# Altium schematic sheet Connector.SchDoc
size A4
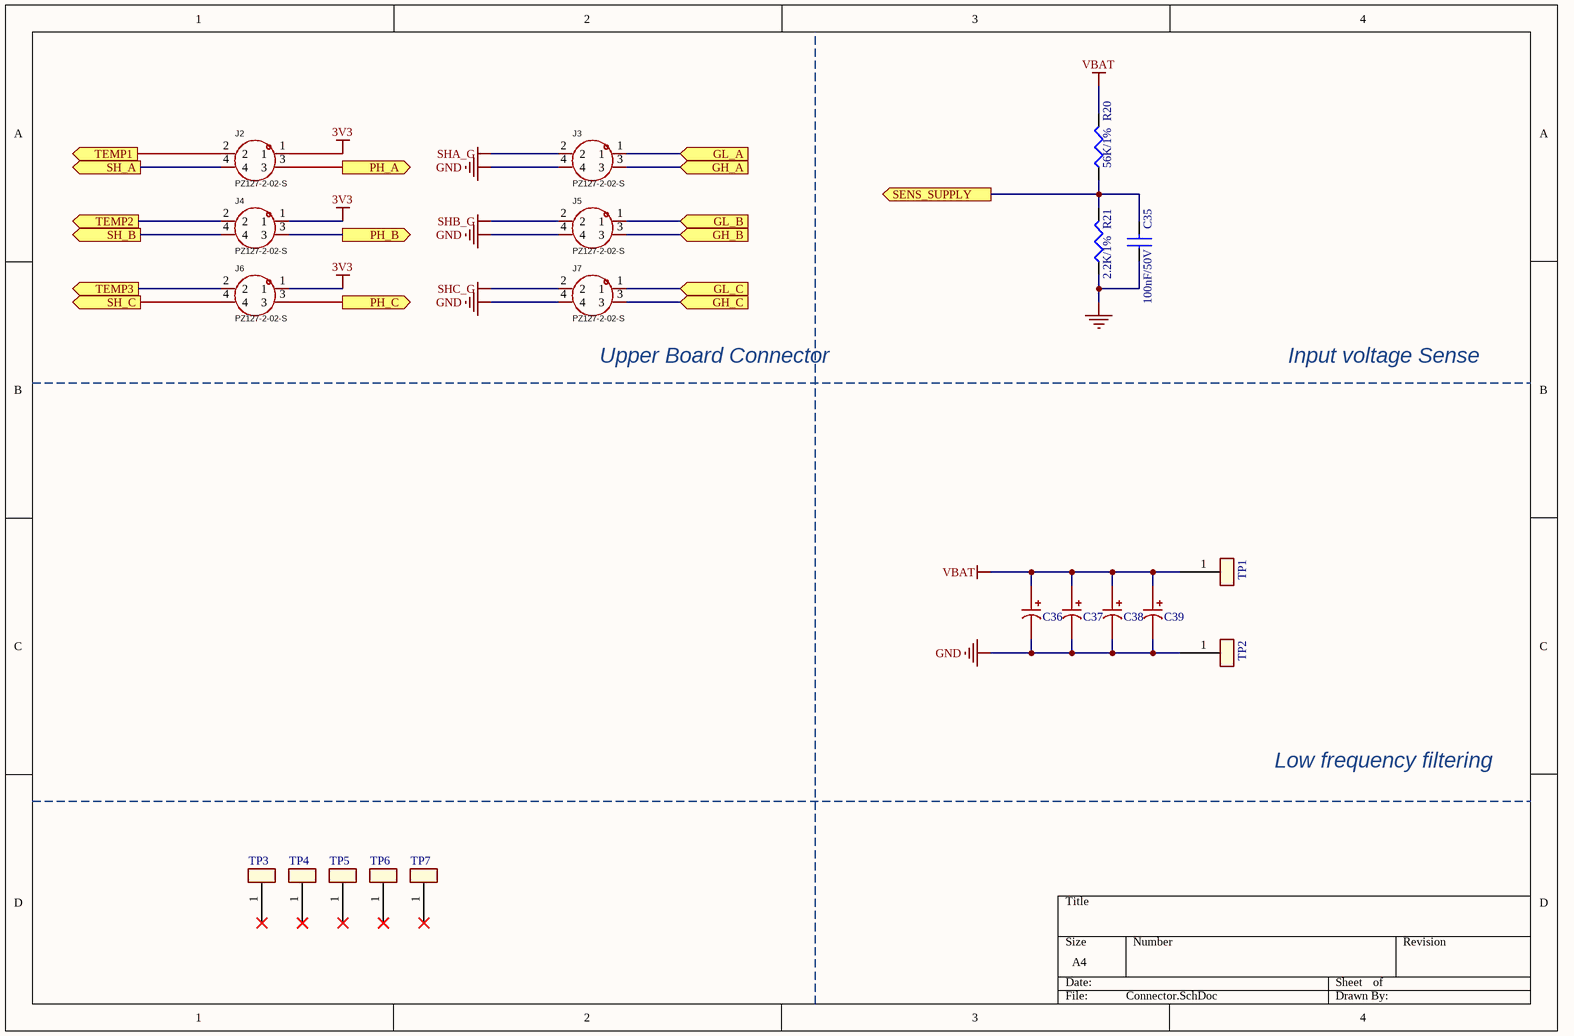
[diagram p0: Connector.SchDoc]

## Parts
C35  100nF/50V  [C0402]
C36  680uF  [CAP-TH_10.0x17mm]  (value not drawn)
C37  680uF  [CAP-TH_10.0x17mm]  (value not drawn)
C38  680uF  [CAP-TH_10.0x17mm]  (value not drawn)
C39  680uF  [CAP-TH_10.0x17mm]  (value not drawn)
J2  PZ127-2-02-S  [HDR-SMD_4P-P1.27-V-M-R2-C2-LS5.3]
J3  PZ127-2-02-S  [HDR-SMD_4P-P1.27-V-M-R2-C2-LS5.3]
J4  PZ127-2-02-S  [HDR-SMD_4P-P1.27-V-M-R2-C2-LS5.3]
J5  PZ127-2-02-S  [HDR-SMD_4P-P1.27-V-M-R2-C2-LS5.3]
J6  PZ127-2-02-S  [HDR-SMD_4P-P1.27-V-M-R2-C2-LS5.3]
J7  PZ127-2-02-S  [HDR-SMD_4P-P1.27-V-M-R2-C2-LS5.3]
R20  56K/1%  [R0402]
R21  2.2K/1%  [R0402]
TP1  TEST POINT  [HOLE-4MM_M]  (value not drawn)
TP2  TEST POINT  [HOLE-4MM_M]  (value not drawn)
TP3  TEST POINT  [HOLE-6.2MM_M]  (value not drawn)
TP4  TEST POINT  [HOLE-6.2MM_M]  (value not drawn)
TP5  TEST POINT  [HOLE-6.2MM_M]  (value not drawn)
TP6  TEST POINT  [HOLE-6.2MM_M]  (value not drawn)
TP7  TEST POINT  [HOLE-6.2MM_M]  (value not drawn)

## Ports
GH_A (in, see VESC_75100[3A]), GH_B (in, see VESC_75100[3B]), GH_C (in, see VESC_75100[3B]), GL_A (in, see VESC_75100[3B]), GL_B (in, see VESC_75100[3B]), GL_C (in, see VESC_75100[3B]), PH_A (out, see VESC_75100[3B]), PH_B (out, see VESC_75100[3B]), PH_C (out, see VESC_75100[3B]), SENS_SUPPLY (out, see VESC_75100[4B]), SH_A (out, see VESC_75100[3B]), SH_B (out, see VESC_75100[3B]), SH_C (out, see VESC_75100[3B]), TEMP1 (out, see VESC_75100[4B]), TEMP2 (out, see VESC_75100[4B]), TEMP3 (out, see VESC_75100[4B])

## Nets
3V3: J2.1 J4.1 J6.1
GND: C35.1 C36.2 C37.2 C38.2 C39.2 J3.4 J5.4 J7.4 R21.1 TP2.1
SHA_G: J3.2
SHB_G: J5.2
SHC_G: J7.2
VBAT: C36.1 C37.1 C38.1 C39.1 R20.2 TP1.1
GH_A: J3.3 ; port GH_A
GH_B: J5.3 ; port GH_B
GH_C: J7.3 ; port GH_C
GL_A: J3.1 ; port GL_A
GL_B: J5.1 ; port GL_B
GL_C: J7.1 ; port GL_C
PH_A: J2.3 ; port PH_A
PH_B: J4.3 ; port PH_B
PH_C: J6.3 ; port PH_C
SENS_SUPPLY: C35.2 R20.1 R21.2 ; port SENS_SUPPLY
SH_A: J2.4 ; port SH_A
SH_B: J4.4 ; port SH_B
SH_C: J6.4 ; port SH_C
TEMP1: J2.2 ; port TEMP1
TEMP2: J4.2 ; port TEMP2
TEMP3: J6.2 ; port TEMP3

Not connected (* = marked no-connect by the designer): TP3 1*; TP4 1*; TP5 1*; TP6 1*; TP7 1*

## Notes on the sheet
- (near J7) Upper Board Connector
- Input voltage Sense
- Low frequency filtering

## Library data of the parts
C35 = CAP NP: PCB Footprint: C0402
C36-C39 = ERS1VM681G16OT: 容值:680uF;精度:±20%;额定电压:35V;纹波电流:-;等效串联电阻:-;; Manufacturer: AISHI(艾华集团); Add into BOM: yes; Tolerance: ±20%; Rated Voltage: 35V; Symbol: ERS1VM681G16OT; Device: ERS1VM681G16OT; LCSC Part Name: 680uF ±20% 35V; Supplier Part: C721283; Manufacturer Part: ERS1VM681G16OT; Supplier Footprint: 插件,D10xL16mm; Datasheet: https://atta.szlcsc.com/upload/public/pdf/source/20191015/C438940_4B8E60A742BB0AE40DDEF87A5C89089D.pdf; Supplier: LCSC; Convert to PCB: yes; Value: 680uF; Ripple Current: -; Equivalent Series Resistance(ESR): -; Lead Spacing: -; φD: -; L: -; Lifetime @ Temp: -
J2-J7 = PZ127-2-02-S: Manufacturer: HCTL(华灿天禄); Add into BOM: yes; Pin Structure: 2x2P; Pitch: 1.27mm; Circluar Pins/Square Pins: 方针; Current Rating (Max): 1A; Soldering Temperature(Max): 260℃@10S; Symbol: PZ127-2-02-S; Device: PZ127-2-02-S; LCSC Part Name: 2x2P 间距:1.27mm 方针 立贴; Supplier Part: C3975185; Manufacturer Part: PZ127-2-02-S; Supplier Footprint: SMD,P=1.27mm; JLCPCB Part Class: Extended Part; Datasheet: https://atta.szlcsc.com/upload/public/pdf/source/20230609/2ACB07ADC7D4DAF6D292F3D23C037F6C.pdf; Supplier: LCSC; Convert to PCB: yes; Row Spacing: 1.27mm; Mounting Type: 立贴; Number of Rows: 双排; Number of Pins: 4P; Length of Mating Pin: 4mm; Insulation Height: 1.5mm; Length of End Connection Pin: -; Contact Material: 黄铜; Operating Temperature Range: -40℃~+105℃; Color: 黑色
R20 R21 = RESISTOR: PCB Footprint: R0402